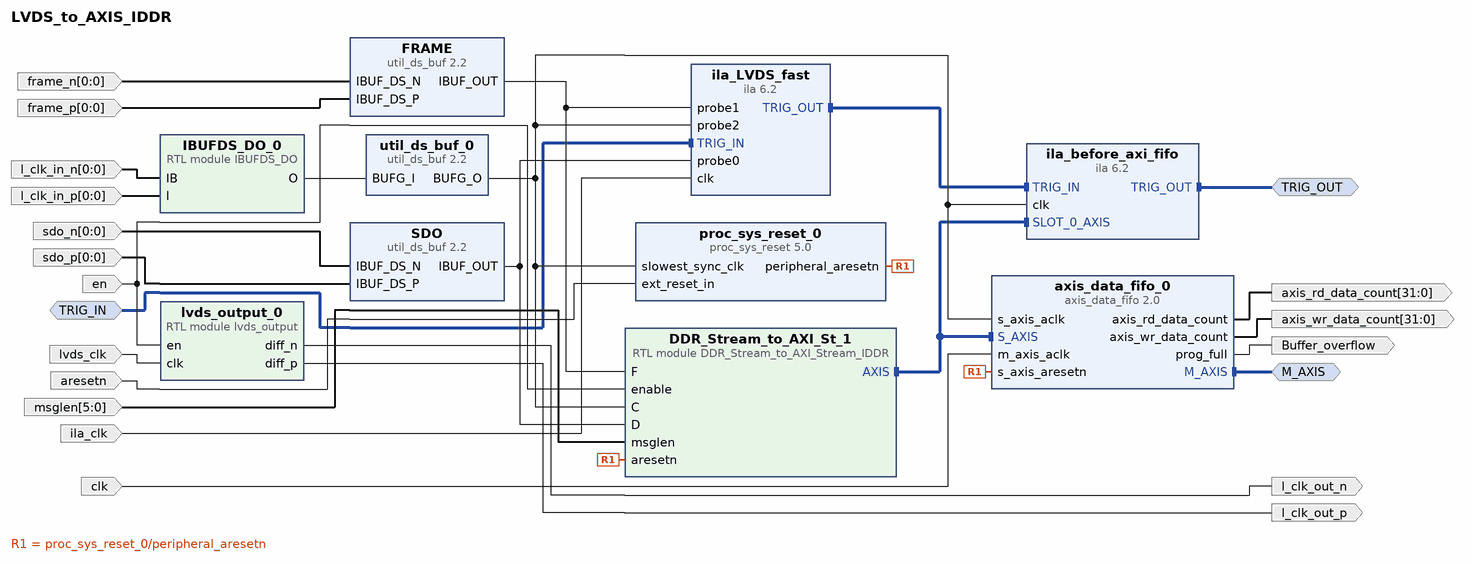
[diagram p0: block diagram of the top level]
# Vivado block design LVDS_to_AXIS_IDDR, xc7z020clg484-1, Vivado 2024.2
create_bd_design LVDS_to_AXIS_IDDR

create_bd_intf_port -mode Master -vlnv xilinx.com:interface:axis_rtl:1.0 M_AXIS
create_bd_intf_port -mode Slave -vlnv xilinx.com:interface:trigger_rtl:1.0 TRIG_IN
create_bd_intf_port -mode Master -vlnv xilinx.com:interface:trigger_rtl:1.0 TRIG_OUT
create_bd_port -dir I -from 0 -to 0 -type clk l_clk_in_n
create_bd_port -dir I -from 0 -to 0 -type clk l_clk_in_p
create_bd_port -dir I -from 0 -to 0 -type clk frame_n
create_bd_port -dir I -from 0 -to 0 -type clk frame_p
create_bd_port -dir I -from 0 -to 0 -type clk sdo_n
create_bd_port -dir I -from 0 -to 0 -type clk sdo_p
create_bd_port -dir O -from 31 -to 0 axis_wr_data_count
create_bd_port -dir O -from 31 -to 0 axis_rd_data_count
create_bd_port -dir O Buffer_overflow
create_bd_port -dir O l_clk_out_p
create_bd_port -dir O l_clk_out_n
create_bd_port -dir I -type clk lvds_clk
create_bd_port -dir I en
create_bd_port -dir I -from 5 -to 0 msglen
create_bd_port -dir I -type rst aresetn
create_bd_port -dir I -type clk clk
create_bd_port -dir I -type clk ila_clk

create_bd_cell -type ip -vlnv xilinx.com:ip:util_ds_buf:2.2 SDO
create_bd_cell -type ip -vlnv xilinx.com:ip:util_ds_buf:2.2 FRAME
create_bd_cell -type ip -vlnv xilinx.com:ip:axis_data_fifo:2.0 axis_data_fifo_0
set_property -dict [list \
  CONFIG.FIFO_DEPTH 16 \
  CONFIG.FIFO_MEMORY_TYPE distributed \
  CONFIG.HAS_AFULL 0 \
  CONFIG.HAS_PROG_FULL 1 \
  CONFIG.HAS_RD_DATA_COUNT 1 \
  CONFIG.HAS_WR_DATA_COUNT 1 \
  CONFIG.IS_ACLK_ASYNC 1 \
  CONFIG.PROG_FULL_THRESH 11 \
  CONFIG.SYNCHRONIZATION_STAGES 2 \
] [get_bd_cells axis_data_fifo_0]
create_bd_cell -type module -reference lvds_output lvds_output_0
create_bd_cell -type ip -vlnv xilinx.com:ip:proc_sys_reset:5.0 proc_sys_reset_0
create_bd_cell -type module -reference DDR_Stream_to_AXI_Stream_IDDR DDR_Stream_to_AXI_St_1
create_bd_cell -type ip -vlnv xilinx.com:ip:ila:6.2 ila_LVDS_fast
set_property -dict [list \
  CONFIG.C_DATA_DEPTH 4096 \
  CONFIG.C_MONITOR_TYPE Native \
  CONFIG.C_NUM_OF_PROBES 3 \
  CONFIG.C_PROBE3_WIDTH 1 \
  CONFIG.C_PROBE4_WIDTH 1 \
  CONFIG.C_PROBE5_WIDTH 1 \
  CONFIG.C_TRIGIN_EN true \
  CONFIG.C_TRIGOUT_EN true \
] [get_bd_cells ila_LVDS_fast]
create_bd_cell -type ip -vlnv xilinx.com:ip:util_ds_buf:2.2 util_ds_buf_0
set_property -dict {CONFIG.C_BUF_TYPE BUFG} [get_bd_cells util_ds_buf_0]
create_bd_cell -type module -reference IBUFDS_DO IBUFDS_DO_0
create_bd_cell -type ip -vlnv xilinx.com:ip:ila:6.2 ila_before_axi_fifo
set_property -dict [list \
  CONFIG.C_SLOT_0_AXI_PROTOCOL AXI4S \
  CONFIG.C_TRIGIN_EN true \
  CONFIG.C_TRIGOUT_EN true \
] [get_bd_cells ila_before_axi_fifo]

# ---- connections ----

connect_bd_intf_net [get_bd_intf_pins DDR_Stream_to_AXI_St_1/AXIS] [get_bd_intf_pins axis_data_fifo_0/S_AXIS]
connect_bd_intf_net [get_bd_intf_pins DDR_Stream_to_AXI_St_1/AXIS] [get_bd_intf_pins ila_before_axi_fifo/SLOT_0_AXIS]
connect_bd_intf_net -intf_net TRIG_IN_0_1 [get_bd_intf_ports TRIG_IN] [get_bd_intf_pins ila_LVDS_fast/TRIG_IN]
connect_bd_intf_net [get_bd_intf_ports M_AXIS] [get_bd_intf_pins axis_data_fifo_0/M_AXIS]
connect_bd_intf_net [get_bd_intf_pins ila_LVDS_fast/TRIG_OUT] [get_bd_intf_pins ila_before_axi_fifo/TRIG_IN]
connect_bd_intf_net [get_bd_intf_ports TRIG_OUT] [get_bd_intf_pins ila_before_axi_fifo/TRIG_OUT]
connect_bd_net [get_bd_pins FRAME/IBUF_OUT] [get_bd_pins ila_LVDS_fast/probe1] [get_bd_pins DDR_Stream_to_AXI_St_1/F]
connect_bd_net [get_bd_pins IBUFDS_DO_0/O] [get_bd_pins util_ds_buf_0/BUFG_I]
connect_bd_net -net IBUF_DS_N_0_1 [get_bd_ports l_clk_in_n] [get_bd_pins IBUFDS_DO_0/IB]
connect_bd_net -net IBUF_DS_N_1_1 [get_bd_ports frame_n] [get_bd_pins FRAME/IBUF_DS_N]
connect_bd_net -net IBUF_DS_N_2_1 [get_bd_ports sdo_n] [get_bd_pins SDO/IBUF_DS_N]
connect_bd_net -net IBUF_DS_P_0_1 [get_bd_ports l_clk_in_p] [get_bd_pins IBUFDS_DO_0/I]
connect_bd_net -net IBUF_DS_P_1_1 [get_bd_ports frame_p] [get_bd_pins FRAME/IBUF_DS_P]
connect_bd_net -net IBUF_DS_P_2_1 [get_bd_ports sdo_p] [get_bd_pins SDO/IBUF_DS_P]
connect_bd_net [get_bd_pins util_ds_buf_0/BUFG_O] \
  [get_bd_pins proc_sys_reset_0/slowest_sync_clk] [get_bd_pins ila_LVDS_fast/probe2] \
  [get_bd_pins axis_data_fifo_0/s_axis_aclk] [get_bd_pins ila_before_axi_fifo/clk] [get_bd_pins DDR_Stream_to_AXI_St_1/C]
connect_bd_net [get_bd_pins SDO/IBUF_OUT] [get_bd_pins ila_LVDS_fast/probe0] [get_bd_pins DDR_Stream_to_AXI_St_1/D]
connect_bd_net -net aresetn_0_1 [get_bd_ports aresetn] [get_bd_pins proc_sys_reset_0/ext_reset_in]
connect_bd_net [get_bd_pins axis_data_fifo_0/axis_rd_data_count] [get_bd_ports axis_rd_data_count]
connect_bd_net [get_bd_pins axis_data_fifo_0/axis_wr_data_count] [get_bd_ports axis_wr_data_count]
connect_bd_net [get_bd_pins axis_data_fifo_0/prog_full] [get_bd_ports Buffer_overflow]
connect_bd_net -net clk_0_1 [get_bd_ports lvds_clk] [get_bd_pins lvds_output_0/clk]
connect_bd_net -net clk_0_2 [get_bd_ports ila_clk] [get_bd_pins ila_LVDS_fast/clk]
connect_bd_net -net en_0_1 [get_bd_ports en] [get_bd_pins lvds_output_0/en] [get_bd_pins DDR_Stream_to_AXI_St_1/enable]
connect_bd_net [get_bd_pins lvds_output_0/diff_n] [get_bd_ports l_clk_out_n]
connect_bd_net [get_bd_pins lvds_output_0/diff_p] [get_bd_ports l_clk_out_p]
connect_bd_net -net m_axis_aclk_0_1 [get_bd_ports clk] [get_bd_pins axis_data_fifo_0/m_axis_aclk]
connect_bd_net -net msglen_0_1 [get_bd_ports msglen] [get_bd_pins DDR_Stream_to_AXI_St_1/msglen]
connect_bd_net [get_bd_pins proc_sys_reset_0/peripheral_aresetn] \
  [get_bd_pins axis_data_fifo_0/s_axis_aresetn] [get_bd_pins DDR_Stream_to_AXI_St_1/aresetn]

validate_bd_design
save_bd_design
